# EAGLE design SilverDollarGame (EAGLE 7.6.0)
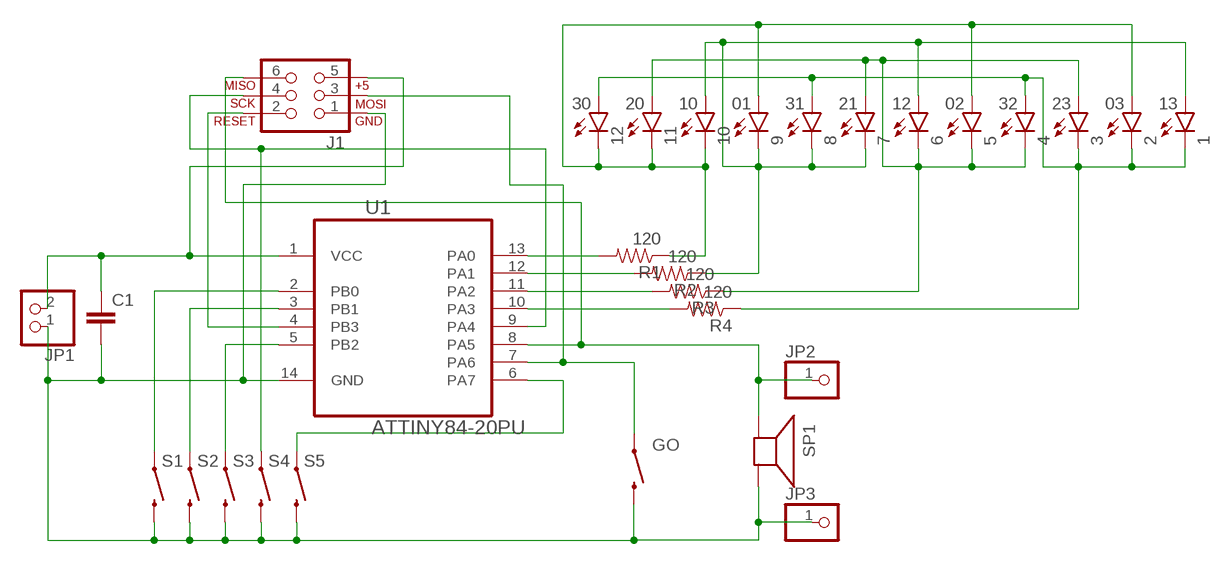
[diagram p0: schematic, sheet 1]

## Parts
1  LED3MM  [LED3MM]
2  LED3MM  [LED3MM]
3  LED3MM  [LED3MM]
4  LED3MM  [LED3MM]
5  LED3MM  [LED3MM]
6  LED3MM  [LED3MM]
7  LED3MM  [LED3MM]
8  LED3MM  [LED3MM]
9  LED3MM  [LED3MM]
10  LED3MM  [LED3MM]
11  LED3MM  [LED3MM]
12  LED3MM  [LED3MM]
C1  0.1UF-50V-20%(PTH)KIT-EZ  [CAP-PTH-SMALL-KIT]
GO  SWITCH-MOMENTARY-2PTH  [TACTILE-PTH]
J1  AVR_SPI_PRG_6TESTPOINTS  [2X3_TEST_POINTS]
JP1  HEADER-1X2ROUND  [1X02_ROUND]
JP2  PINHD-1X1CB  [1X01-CLEANBIG]
JP3  PINHD-1X1CB  [1X01-CLEANBIG]
R1  120  RESISTORAXIAL-0.3  [AXIAL-0.3]
R2  120  RESISTORAXIAL-0.3  [AXIAL-0.3]
R3  120  RESISTORAXIAL-0.3  [AXIAL-0.3]
R4  120  RESISTORAXIAL-0.3  [AXIAL-0.3]
S1  SWITCH-MOMENTARY-2PTH  [TACTILE-PTH]
S2  SWITCH-MOMENTARY-2PTH  [TACTILE-PTH]
S3  SWITCH-MOMENTARY-2PTH  [TACTILE-PTH]
S4  SWITCH-MOMENTARY-2PTH  [TACTILE-PTH]
S5  SWITCH-MOMENTARY-2PTH  [TACTILE-PTH]
SP1  ABT-402-RC  SPEAKER/AL60P  [AL60P]
U1  ATTINY84-20PU  [DIP254P762X533-14]

## Nets
N$1: R3.P$2 U1.11(PA2)
N$2: R4.P$2 U1.10(PA3)
N$3: C1.1 J1.5 JP1.2 U1.1(VCC)
N$4: R1.P$2 U1.13(PA0)
N$5: 2.A 5.A 9.A 10.K(C) 11.K(C) 12.K(C) R1.P$1
N$6: R2.P$2 U1.12(PA1)
N$7: 3.A 4.K(C) 5.K(C) 6.K(C) 7.A 11.A R3.P$1
N$8: C1.2 GO.3 J1.1 JP1.1 JP3.1 S1.3 S2.3 S3.3 S4.3 S5.3 SP1.2(-) U1.14(GND)
N$9: 1.A 6.A 7.K(C) 8.K(C) 9.K(C) 10.A R2.P$1
N$10: S1.1 U1.2(PB0)
N$11: GO.1 J1.3 U1.7(PA6)
N$12: J1.2 U1.4(PB3)
N$13: S2.1 U1.3(PB1)
N$14: S3.1 U1.5(PB2)
N$15: S5.1 U1.6(PA7)
N$18: J1.6 JP2.1 SP1.1(+) U1.8(PA5)
N$20: J1.4 S4.1 U1.9(PA4)
N$21: 1.K(C) 2.K(C) 3.K(C) 4.A 8.A 12.A R4.P$1

## Notes on the sheet
- 30 | 20 | 10 | 01 | 31 | 21 | 12 | 02 | 32 | 23 | 03 | 13

## Library data of the parts
1-12 = SparkFun-LED:LED: LEDs Standard schematic elements and footprints for 5mm, 3mm, 1206, and 0603 sized LEDs. 5mm - Spark Fun Electronics SKU : COM-00529 (and others); PROD_ID: DIO-08794
C1 = SparkFun-Capacitors:0.1UF-50V-20%(PTH): CAP-08370; PROD_ID: CAP-08370
GO S1-S5 = SparkFun-Electromechanical:SWITCH-MOMENTARY-2: Various NO switches- pushbuttons, reed, etc; PROD_ID: SWCH-08441
J1 = technoblogy:AVR_SPI_PRG_6: AVR ISP 6 Pin This is the reduced ISP connector for AVR programming. Common on Arduino. This footprint will take up less PCB space and can be used with a 10-pin to 6-pin adapter such as SKU: BOB-08508 **Special note about "TEST_POINT" package. The stop mask is on the top side, so if you want your programming test points to be on the bottom of your board, make sure to place this package on the bottom side of the board. This also ensure that the orientation to program from the bottom side will be correct.
JP1 = microbuilder:HEADER-1X2: PIN HEADER
JP2 JP3 = adafruit:PINHD-1X1: Pin header 1x1 for 0.1" spacing With round pins
R1-R4 = SparkFun-Passives:RESISTOR: Resistor Basic schematic elements and footprints for 0603, 1206, and PTH resistors.
SP1 = adafruit:SPEAKER: SPEAKER Source: Buerklin Added PS12 (for part # PS1240 piezo) http://www.ladyada.net/library/pcb/eaglelibrary.html
U1 = Atmel_By_element14_Batch_1-00:ATTINY84-20PU: 8-bit Microcontroller with In-System Programmable Flash; MPN: ATTINY84-20PU; OC_FARNELL: -; OC_NEWARK: 58M3794; PACKAGE: PDIP-14; SUPPLIER: Atmel

## Net classes
0 default: width 0.152 mm, drill 0.305 mm, clearance 0.152 mm

## Board
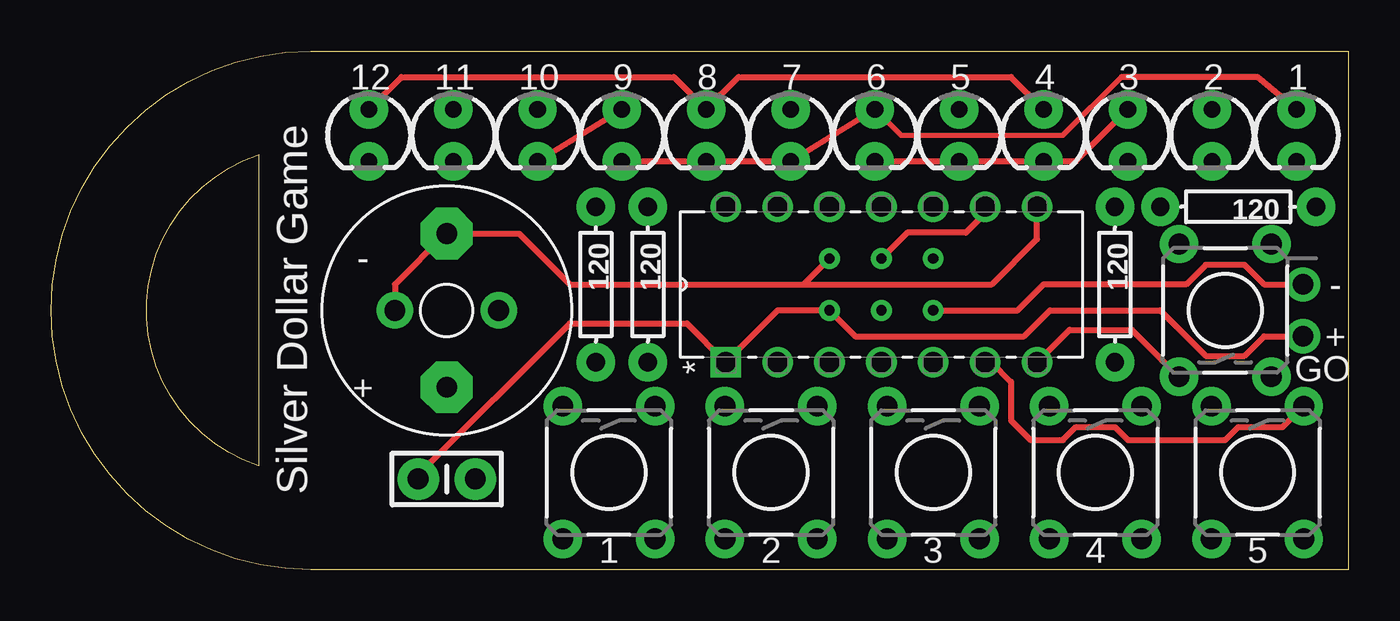
[diagram p1: board, top side]
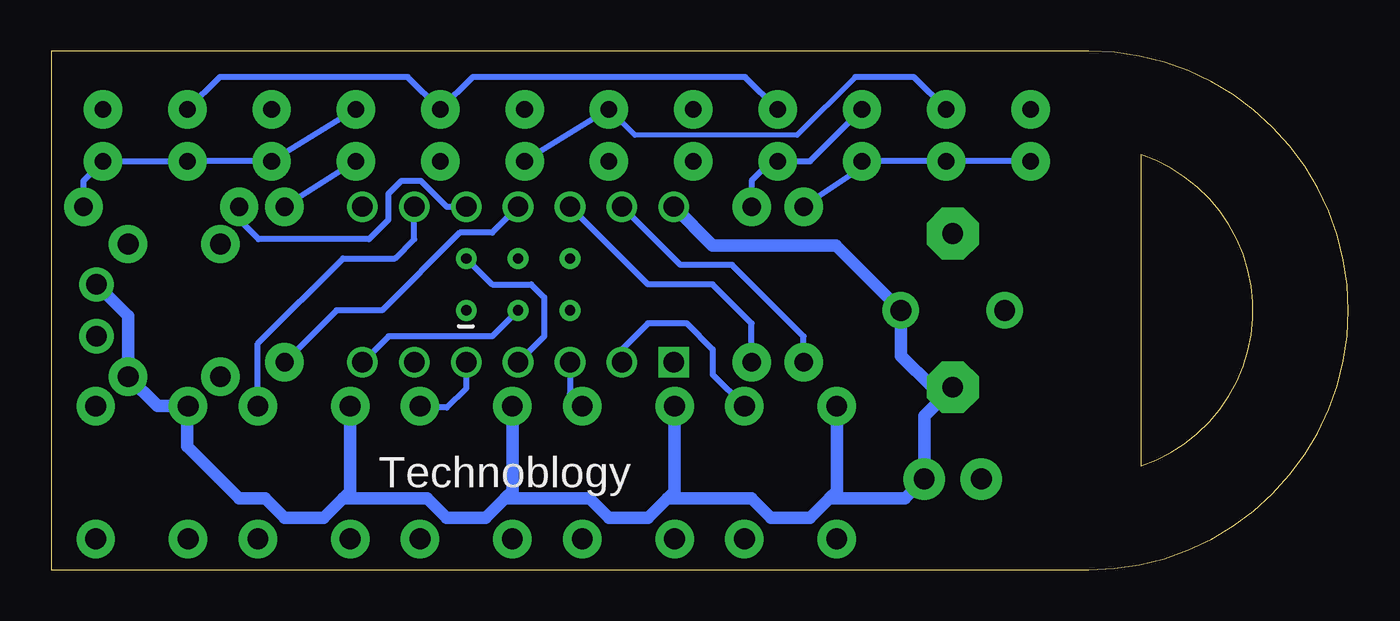
[diagram p2: board, bottom side, seen from below]

Size 63.5 x 25.4 mm. Coordinates in mm from the lower left corner, seen from the top.
Outline: 12.7,25.4 63.5,25.4 63.5,0 12.7,0 arc-180 12.7,25.4
Outline: 10.16,5.08 arc-143 10.16,20.32 10.16,5.08
Copper layers (1*16): Top 0.035mm / dielectric 1.5mm / Bottom 0.035mm
Design rules "default": minimum track width 10mil, minimum drill 24mil, track to track 8mil, track to pad 8mil, pad to pad 8mil, via to via 8mil, smd to smd 8mil, copper to edge 40mil, drill to drill 8mil, minimum pad ring 10mil, minimum via ring 8mil, stop-mask expansion 4mil, vias tented up to drill 0mil, thermal gap 10mil

### Footprints (pad centres in the part's own frame; a part is rotated, then mirrored left to right if it is on the bottom)
LED3MM = drill 0.813 pad 1.88: A -1.27,0; K 1.27,0
CAP-PTH-SMALL-KIT = drill 1.016 pad 2.032: 1 -1.397,0; 2 1.397,0
TACTILE-PTH = drill 1.016 pad 1.88: 1 -3.251,2.261; 2 3.251,2.261; 3 -3.251,-2.261; 4 3.251,-2.261
2X3_TEST_POINTS = drill 0.508: 1 -2.54,-1.27; 2 -2.54,1.27; 3 0,-1.27; 4 0,1.27; 5 2.54,-1.27; 6 2.54,1.27
1X02_ROUND = drill 1 pad 1.676: 1 -1.27,0; 2 1.27,0
1X01-CLEANBIG = drill 1.016 pad 1.778: 1 0,0
AXIAL-0.3 = drill 0.9 pad 1.88: P$1 -3.81,0; P$2 3.81,0
AL60P = drill 1.016 pad 2.54 octagon: 1 -3.759,0; 2 3.759,0
DIP254P762X533-14 = drill 0.991 square: 1 -7.62,15.24 | drill 0.991: 2 -7.62,12.7; 3 -7.62,10.16; 4 -7.62,7.62; 5 -7.62,5.08; 6 -7.62,2.54; 7 -7.62,0; 8 0,0; 9 0,2.54; 10 0,5.08; 11 0,7.62; 12 0,10.16; 13 0,12.7; 14 0,15.24

### Placement (x,y rotation side)
1  60.96,21.27 270 top
2  56.83,21.27 270 top
3  52.7,21.27 270 top
4  48.58,21.27 270 top
5  44.45,21.27 270 top
6  40.32,21.27 270 top
7  36.2,21.27 270 top
8  32.07,21.27 270 top
9  27.94,21.27 270 top
10  23.81,21.27 270 top
11  19.68,21.27 270 top
12  15.56,21.27 270 top
C1  19.37,4.45 0 top
GO  57.47,12.7 90 top
J1  40.64,13.97 0 bottom
JP1  61.28,12.7 270 top
JP2  16.83,12.7 0 top
JP3  21.91,12.7 0 top
R1  26.67,13.97 270 top
R2  29.21,13.97 270 top
R3  52.07,13.97 270 top
R4  58.1,17.78 180 top
S1  27.3,4.76 270 top
S2  35.24,4.76 270 top
S3  43.18,4.76 270 top
S4  51.12,4.76 270 top
S5  59.05,4.76 270 top
SP1  19.37,12.7 270 top
U1  48.26,17.78 90 top

### Tracks (layer width: path | path; a pad name or v marks a point on that pad's centre or on a via)
N$1
  Bottom 0.305: U1.11 41.91,16.51 43.5,16.51 47.31,12.7 49.53,12.7 R3.P$2
N$2
  Bottom 0.305: R4.P$2 54.29,17.14 53.34,16.19 47.94,16.19 46.99,17.14 46.99,18.41 46.35,19.05 45.4,19.05 44.13,17.78 U1.10
N$3
  Top 0.305: JP1.2 59.37,11.43 58.42,10.48 56.52,10.48 54.29,12.7 48.9,12.7 47.62,11.43 39.37,11.43 J1.5 35.56,12.7 U1.1 31.11,12.06 25.4,12.06 17.97,4.64 C1.1
  Top 0.406: JP1.2 60.64,11.43
N$4
  Bottom 0.305: R1.P$2 26.67,11.43 30.16,14.92 32.7,14.92 U1.13
N$5
  Top 0.305: 10.K 9.A
  Bottom 0.305: 12.K 11.K 10.K 23.81,19.68 R1.P$1 | 9.A 29.53,24.13 42.86,24.13 5.A 46.04,24.13 55.24,24.13 2.A
N$6
  Bottom 0.305: R2.P$2 29.21,12.06 31.11,13.97 34.29,13.97 U1.12
N$7
  Top 0.305: 6.K 5.K 4.K 50.16,20 3.A
  Bottom 0.254: 24.13,24.13 26.99,21.27 34.92,21.27 7.A
  Bottom 0.305: 4.K R3.P$1 | 7.A 6.K | 11.A 21.27,24.13 24.13,24.13
N$8
  Top 0.305: J1.1 47.31,12.7 48.58,13.97 55.56,13.97 56.52,14.92 58.42,14.92 59.37,13.97 JP1.1
  Bottom 0.61: JP1.1 59.73,12.42 GO.3 58.29,8.01 S5.3 56.83,7.98 56.83,6.03 54.29,3.49 53.02,3.49 52.07,2.54 50.16,2.54 49.21,3.49 | U1.14 31.11,15.88 25.08,15.88 JP3.1 21.91,10.48 20.37,8.94 SP1.2 20.77,7.54 C1.2 21.72,3.49 25.4,3.49 | S3.3 40.92,3.85 41.27,3.49 | 49.21,3.49 45.09,3.49 44.13,2.54 42.23,2.54 41.27,3.49 | 41.27,3.49 37.15,3.49 36.2,2.54 34.29,2.54 33.34,3.49 | 33.34,3.49 29.21,3.49 28.26,2.54 26.35,2.54 25.4,3.49 | S1.3 25.04,3.85 25.4,3.49 | S2.3 32.98,3.85 33.34,3.49 | S4.3 48.86,3.85 49.21,3.49
N$9
  Top 0.254: 6.A 41.59,21.27 49.53,21.27 52.39,24.13
  Top 0.305: 9.K 8.K 7.K 6.A | 1.A 59.05,24.13 52.39,24.13
  Bottom 0.305: 10.A 26.35,20 9.K 28.26,20 29.21,19.05 R2.P$1
N$10
  Bottom 0.305: U1.2 35.56,10.79 34.29,12.06 32.38,12.06 31.11,10.79 31.11,9.56 S1.1
N$11
  Top 0.305: U1.7 49.85,11.75 52.91,11.75 GO.1
  Bottom 0.305: U1.7 46.99,11.43 41.91,11.43 J1.3
N$12
  Bottom 0.305: J1.2 41.91,13.97 40.01,13.97 39.37,13.34 39.37,11.43 U1.4
N$13
  Bottom 0.305: U1.3 38.1,8.61 S2.1
N$14
  Bottom 0.305: U1.5 43.18,8.89 44.13,7.94 45.36,7.94 S3.1
N$15
  Top 0.305: U1.6 46.04,10.16 46.99,9.21 46.99,7.3 47.94,6.35 49.53,6.35 50.16,6.99 52.07,6.99 52.7,6.35 57.47,6.35 58.1,6.99 60.29,6.99 S5.1
N$18
  Top 0.305: SP1.1 22.91,16.46 25.4,13.97 36.83,13.97 | 36.83,13.97 46.04,13.97 48.26,16.19 U1.8 | J1.6 36.83,13.97 | 19.32,16.46 16.83,13.97 JP2.1
  Top 0.406: SP1.1 19.32,16.46
N$20
  Top 0: 45.72,17.46 U1.9
  Top 0.305: J1.4 41.91,16.51 44.77,16.51 45.72,17.46
  Bottom 0.305: S4.1 53.38,11.07 49.21,15.24 46.67,15.24 45.72,16.19 U1.9
N$21
  Top 0.305: 12.A 17.14,24.13 30.48,24.13 8.A 33.66,24.13 46.99,24.13 4.A
  Bottom 0.305: 4.A 3.K 2.K 1.K 61.91,19.05 R4.P$1

### Text on the board
tPlace: - | Silver Dollar Game | +
bPlace: Technoblogy
tNames: - | + | 1 | 2 | 3 | 4 | 5